# Altium schematic sheet ESP32S3.SchDoc
size A; SheetNumber: 2; SheetTotal: 2
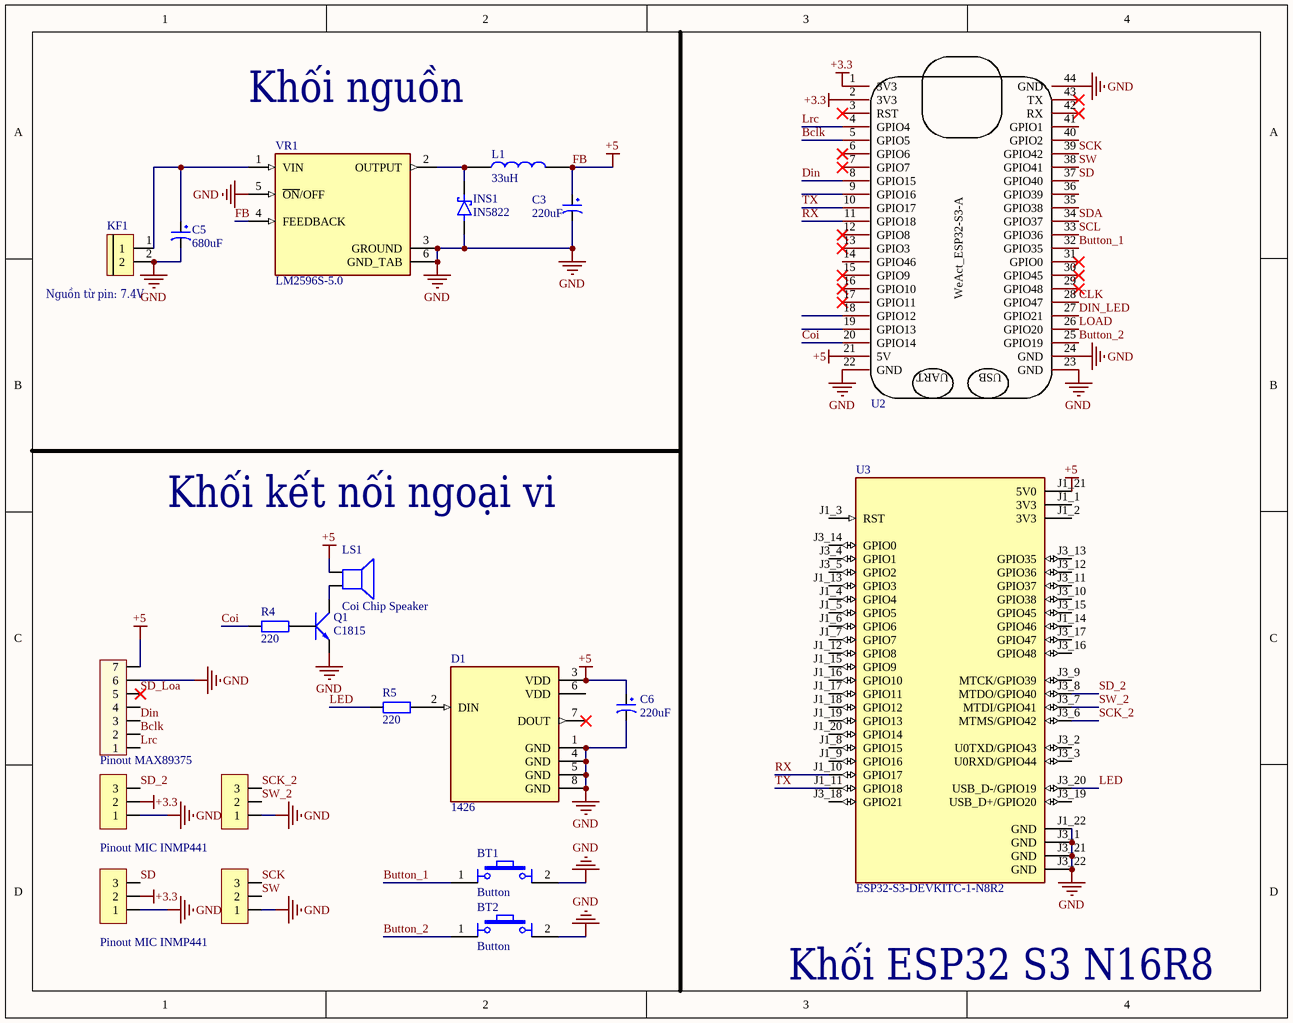
[diagram p0: ESP32S3.SchDoc]

## Parts
BT1  Button  [Nut Nhan 4 Chan Cam 6x6]
BT2  Button  [Nut Nhan 4 Chan Cam 6x6]
C3  220uF  [Tu Hoa 6.5MM]
C5  680uF  [TU HOA 8mm]
C6  220uF  [Tu Hoa 6.5MM]
D1  1426  [LED_1426]
H2  Pinout MAX89375  [Header 7P DC 2.54]
INS1  IN5822  [DIOM5226X240N]
JP2  Pinout MIC INMP441  [JP 1x3 DT]
JP3  MIC INMP441  [JP 1x3 DT]  (value not drawn)
JP4  Pinout MIC INMP441  [JP 1x3 DT]
JP5  MIC INMP441  [JP 1x3 DT]  (value not drawn)
KF1  Nguồn từ pin: 7.4V  [Con 2 KF301 5.08]
L1  33uH  [CUON CAM 100uH3A]
LS1  Coi Chip Speaker  [Coi Chip Speacker]
Q1  C1815  [TO92]
R4  220  [tro smd 1206]
R5  220  [tro smd 1206]
U2  WeAct-ESP32-S3-A  [WeAct-ESP32-S3-A]  (value not drawn)
U3  ESP32-S3-DEVKITC-1-N8R2  [XCVR_ESP32-S3-DEVKITC-1-N8R2]
VR1  LM2596S-5.0  [TO170P1524X483-6N]

## Nets
+3.3: JP2.2 JP4.2 U2.1(3V3) U2.2(3V3)
FB: C3.1 C6.1 D1.3(VDD) H2.7 L1.2 LS1.1 U2.21(5V) U3.J1_21(5V0) VR1.4(FEEDBACK)  [also labelled +5]
GND: BT1.2 BT2.2 C3.2 C5.2 C6.2 D1.1(GND) D1.4(GND) D1.5(GND) D1.8(GND) H2.6 INS1.A JP2.1 JP3.1 JP4.1 JP5.1 KF1.2 Q1.1(E) U2.22(GND) U2.23(GND) U2.24(GND) U2.44(GND) U3.J1_22(GND) U3.J3_1(GND) U3.J3_21(GND) U3.J3_22(GND) VR1.3(GROUND) VR1.5(~{ON}/OFF) VR1.6(GND_TAB)
Bclk: H2.2 U2.5(GPIO5)
Button_1: BT1.1 U2.32(GPIO35)
Button_2: BT2.1 U2.25(GPIO19)
CLK: U2.28(GPIO47)
Coi: R4.1 U2.20(GPIO14)
Din: H2.3 U2.8(GPIO15)
DIN_LED: U2.27(GPIO21)
LED: R5.1 U3.J3_20(USB_D-/GPIO19)
LOAD: U2.26(GPIO20)
Lrc: H2.1 U2.4(GPIO4)
RX: U2.11(GPIO18) U3.J1_10(GPIO17)
SCK: JP5.3 U2.39(GPIO42)
SCK_2: JP3.3 U3.J3_6(MTMS/GPIO42)
SCL: U2.33(GPIO36)
SD: JP4.3 U2.37(GPIO40)
SD_2: JP2.3 U3.J3_8(MTDO/GPIO40)
SD_Loa: H2.5
SDA: U2.34(GPIO37)
SW: JP5.2 U2.38(GPIO41)
SW_2: JP3.2 U3.J3_7(MTDI/GPIO41)
TX: U2.10(GPIO17) U3.J1_11(GPIO18)
NetC5_1: C5.1 KF1.1 VR1.1(VIN)
NetD1_2: D1.2(DIN) R5.2
NetINS1_C: INS1.C L1.1 VR1.2(OUTPUT)
NetLS1_2: LS1.2 Q1.2(C)
NetQ1_3: Q1.3(B) R4.2

Not connected (* = marked no-connect by the designer): D1 6(VDD) 7(DOUT)*; H2 4; U2 3(RST)* 6(GPIO6)* 7(GPIO7)* 9(GPIO16) 12(GPIO8)* 13(GPIO3)* 14(GPIO46) 15(GPIO9)* 16(GPIO10)* 17(GPIO11)* 18(GPIO12) 19(GPIO13) 29(GPIO48)* 30(GPIO45)* 31(GPIO0)* 35(GPIO38) 36(GPIO39) 40(GPIO2) 41(GPIO1) 42(RX)* 43(TX)*; U3 J1_1(3V3) J1_2(3V3) J1_3(RST) J1_4(GPIO4) J1_5(GPIO5) J1_6(GPIO6) J1_7(GPIO7) J1_8(GPIO15) J1_9(GPIO16) J1_12(GPIO8) J1_13(GPIO3) J1_14(GPIO46) J1_15(GPIO9) J1_16(GPIO10) J1_17(GPIO11) J1_18(GPIO12) J1_19(GPIO13) J1_20(GPIO14) J3_2(U0TXD/GPIO43) J3_3(U0RXD/GPIO44) J3_4(GPIO1) J3_5(GPIO2) J3_9(MTCK/GPIO39) J3_10(GPIO38) J3_11(GPIO37) J3_12(GPIO36) J3_13(GPIO35) J3_14(GPIO0) J3_15(GPIO45) J3_16(GPIO48) J3_17(GPIO47) J3_18(GPIO21) J3_19(USB_D+/GPIO20)

## Notes on the sheet
- Khối nguồn
- Khối kết nối ngoại vi
- Khối ESP32 S3 N16R8
- (in symbol WeAct-ESP32-S3-A) WeAct_ESP32-S3-A; UART; USB

## Library data of the parts
BT1 BT2 = Nut Nhan 4 Chan Cam 6x6: Nut Nhan 4 Chan 6x6mm; Ten: Nút Nhấn 4 Chân 6x6x5MM DIP; Ma_Hang: MH004584
C3 C5 C6 = Tu Hoa 22uF 400V 13x20: Cắm; Don_Vi: Con; So_Chan: 2; Ten_Linh_Kien: Tụ Hóa 22uF 400V 13x20MM; Ma_Hang: MH004801; Chung_Loai: Cắm; Kieu_Chan: *
D1 = 1426: NeoPixel Stick - 8 x WS2812 5050 RGB LED with Integrated Drivers | Adafruit Industries 1426; SnapEDA_Link: https://www.snapeda.com/parts/1426/Adafruit+Industries/view-part/?ref=snap; Package: None; Value: *; MF: Adafruit; MP: 1426; Check_prices: https://www.snapeda.com/parts/1426/Adafruit+Industries/view-part/?ref=eda
H2 = Header 7P 2.54 Duc Cong: Cắm; Ten_Linh_Kien: Header 7P XH2.54-7P Đực Cong; Don_Vi: Con; Ma_Hang: MH004118; Chung_Loai: Cắm
INS1 = B340A-13-F: Diode Schottky 40V 3A Surface Mount SMA; MF: Diodes Inc.; Availability: Unavailable; MP: B340A-13-F; Price: None; Value: *; SnapEDA_Link: https://www.snapeda.com/parts/B340A-13-F/Diodes%20Inc./view-part/78704/?ref=snap; Package: DO-214 Diodes Inc.
JP2-JP5 = JP 1x3 2.54 Duc Thang: Cắm; Ten_Linh_Kien: Jump Đơn Đực 2.54MM 1x40P Thẳng 11MM; Don_Vi: Con; Ma_Hang: MH000903; Ghi_Chu: *; Kieu_Chan: *; Chung_Loai: Cắm
KF1 = CON 2 KF301: Cắm; Ma_Hang: MH000987; Ten_Linh_Kien: CON 2 KF301-2P 5.08MM Xanh Dương; Don_Vi: Con; Chung_Loai: Cắm; Ghi_Chu: *; Kieu_Chan: *
L1 = CUON CAM 100uH DIP: Dán; Don_Vi: Con; Ma_Hang: MH002209; Ten_Linh_Kien: Cuộn Cảm 100uH 3A 8x10MM; Chung_Loai: Dán; Ghi Chu: *; Kieu Chan: *
LS1 = Coi Chip Speaker: Còi chip
Q1 = Trans C1815 DIP: NPN transistor; Value: C9014
R4 R5 = Tro 1206 5% 1k: Dán; Don_Vi: Con; So_Chan: 2; Ten_Linh_Kien: Trở 1206 5% 1k; Ma_Hang: MH005904; Chung_Loai: Dán; Kieu_Chan: *
U2 = WeAct-ESP32-S3-A: Add into BOM: yes; Symbol: WeAct-ESP32-S3-A; Device: WeAct-ESP32-S3-A; Convert to PCB: yes
U3 = ESP32-S3-DEVKITC-1-N8R2: WiFi Development Tools - 802.11 (Engineering Samples Only) ESP32-S3 General-Purpose Development Board, ESP32-S3-WROOM-1-N8R2, with Pin Header; MF: Espressif Systems; SnapEDA_Link: https://www.snapeda.com/parts/ESP32-S3-DEVKITC-1-N8R2/Espressif+Systems/view-part/?ref=snap; Package: None; Value: *; MP: ESP32-S3-DEVKITC-1-N8R2; Check_prices: https://www.snapeda.com/parts/ESP32-S3-DEVKITC-1-N8R2/Espressif+Systems/view-part/?ref=eda
VR1 = LM2596S-5.0: SIMPLE SWITCHER&reg; 4.5V to 40V, 3A Low Component Count Step-Down Regulator; MP: LM2596S-5.0/NOPB; MF: Texas Instruments; Price: None; Availability: In Stock; Package: TO-263-5 Texas Instruments; SnapEDA_Link: https://www.snapeda.com/parts/LM2596S-5.0/NOPB/Texas+Instruments/view-part/?ref=snap; Check_prices: https://www.snapeda.com/parts/LM2596S-5.0/NOPB/Texas+Instruments/view-part/?ref=eda; Value: *; Purchase-URL: https://pricing.snapeda.com/search/part/LM2596S-5.0/NOPB/?ref=eda